# Altium project ATT-Light.PrjPcb
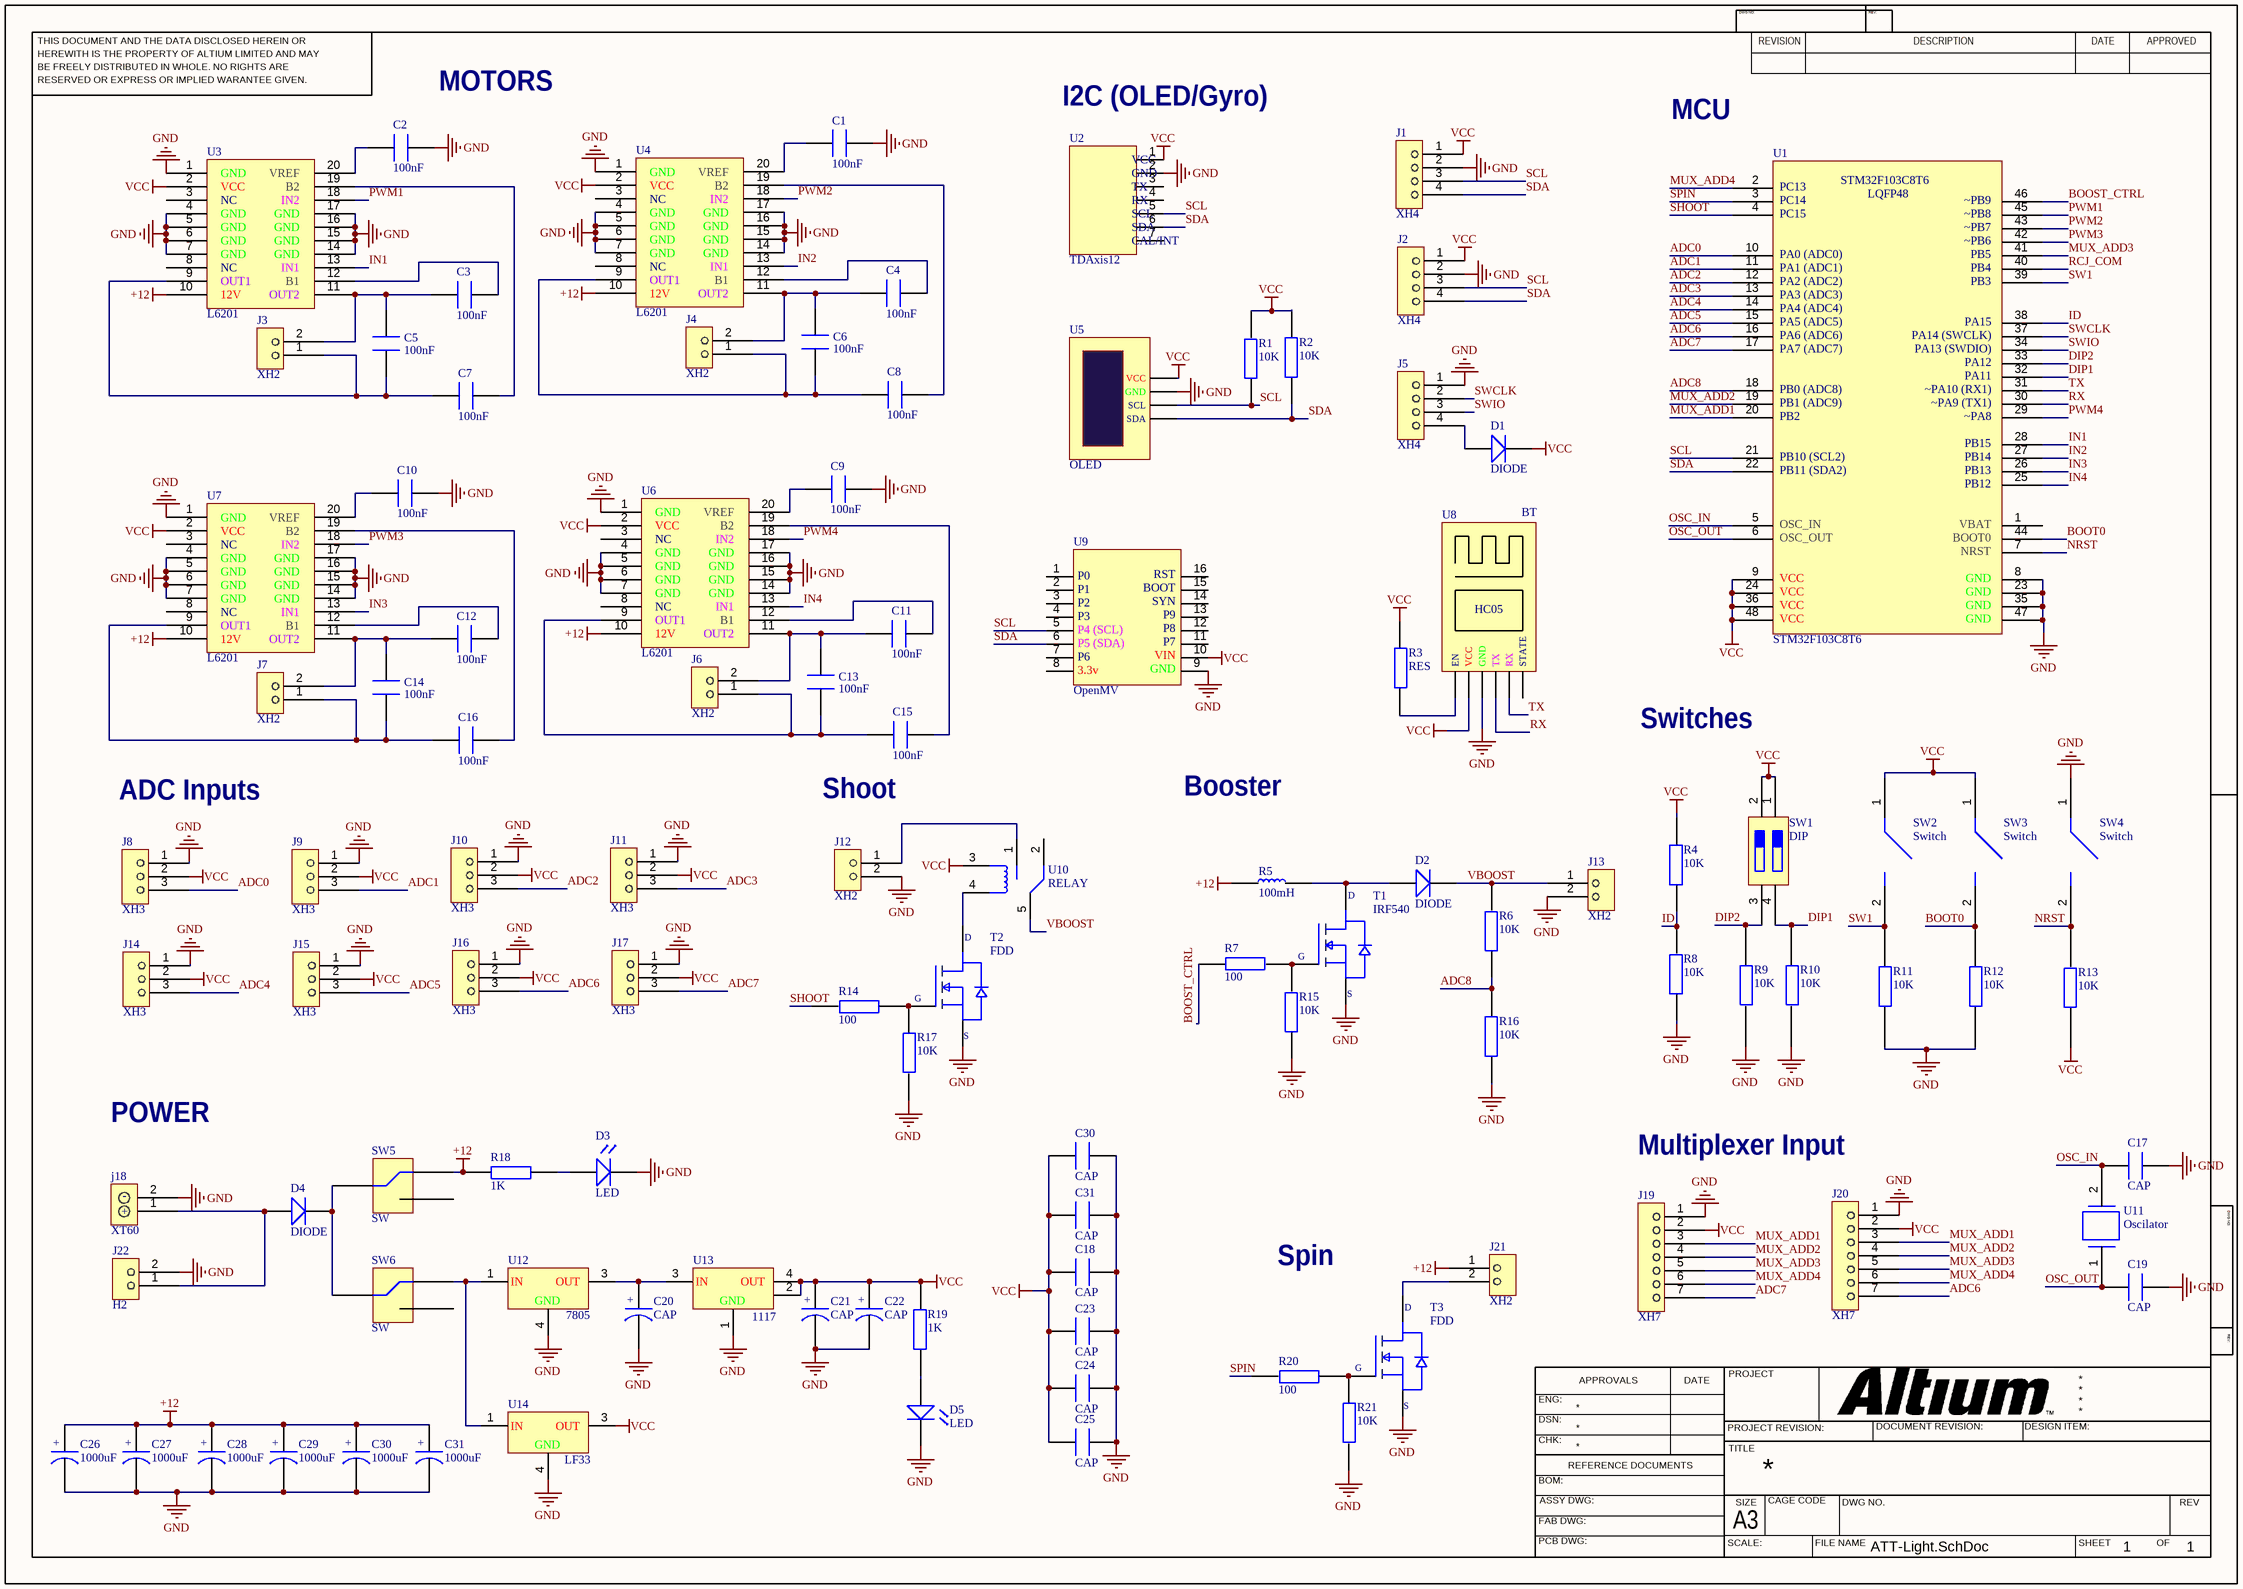
[diagram p0: ATT-Light.SchDoc]
1 sheet, 104 parts. Net scope: global (net labels, ports and power ports of the same name join across sheets).
Board file: ATT-Light.PcbDoc

## Sheet ATT-Light.SchDoc
size 420 x 297 mm; SheetNumber: 1; SheetTotal: 1

### Parts
(Parts that share a designator on the sheet are numbered #1, #2 ... from top to bottom, then left to right.)
C1  100nF  [CAP1206]
C2  100nF  [CAP1206]
C3  100nF  [CAP1206]
C4  100nF  [CAP1206]
C5  100nF  [CAP1206]
C6  100nF  [CAP1206]
C7  100nF  [CAP1206]
C8  100nF  [CAP1206]
C9  100nF  [CAP1206]
C10  100nF  [CAP1206]
C11  100nF  [CAP1206]
C12  100nF  [CAP1206]
C13  100nF  [CAP1206]
C14  100nF  [CAP1206]
C15  100nF  [CAP1206]
C16  100nF  [CAP1206]
C17  CAP  [CAP1206]
C18  CAP  [CAP1206]
C19  CAP  [CAP1206]
C20  CAP  [CAP SMD 100uF 16V]
C21  CAP  [CAP SMD 100uF 16V]
C22  CAP  [CAP SMD 100uF 16V]
C23  CAP  [CAP1206]
C24  CAP  [CAP1206]
C25  CAP  [CAP1206]
C26  1000uF  [CAP 5x10x13 black]
C27  1000uF  [CAP 5x10x13 black]
C28  1000uF  [CAP 5x10x13 black]
C29  1000uF  [CAP 5x10x13 black]
C30#1  CAP  [CAP1206]
C30#2  1000uF  [CAP 5x10x13 black]
C31#1  CAP  [CAP1206]
C31#2  1000uF  [CAP 5x10x13 black]
D1  DIODE  [Diode]
D2  DIODE  [Diode]
D3  LED  [LED GREEN 1206]
D4  DIODE  [Diode]
D5  LED  [LED GREEN 1206]
J1  XH4  [XH 4PIN]
J2  XH4  [XH 4PIN]
J3  XH2  [XH 2pin]
J4  XH2  [XH 2pin]
J5  XH4  [XH 4PIN]
J6  XH2  [XH 2pin]
J7  XH2  [XH 2pin]
J8  XH3  [XH 3PIN]
J9  XH3  [XH 3PIN]
J10  XH3  [XH 3PIN]
J11  XH3  [XH 3PIN]
J12  XH2  [XH 2pin]
J13  XH2  [XH 2pin]
J14  XH3  [XH 3PIN]
J15  XH3  [XH 3PIN]
J16  XH3  [XH 3PIN]
J17  XH3  [XH 3PIN]
j18  XT60  [XT60]
J19  XH7  [XH 7PIN]
J20  XH7  [XH 7PIN]
J21  XH2  [XH 2pin]
J22  H2  [H2 MOLEX]
R1  10K  [RES1206]
R2  10K  [RES1206]
R3  RES  [RES1206]
R4  10K  [RES1206]
R5  100mH  [inductor]
R6  10K  [RES1206]
R7  100  [RES1206]
R8  10K  [RES1206]
R9  10K  [RES1206]
R10  10K  [RES1206]
R11  10K  [RES1206]
R12  10K  [RES1206]
R13  10K  [RES1206]
R14  100  [RES1206]
R15  10K  [RES1206]
R16  10K  [RES1206]
R17  10K  [RES1206]
R18  1K  [RES1206]
R19  1K  [RES1206]
R20  100  [RES1206]
R21  10K  [RES1206]
SW1  DIP  [DIP Switch 2]
SW2  Switch  [pushbutton]
SW3  Switch  [pushbutton]
SW4  Switch  [pushbutton]
SW5  SW  [SPDT Switch]
SW6  SW  [SPDT Switch]
T1  IRF540  [IRF540S]
T2  FDD  [FDD6690A]
T3  FDD  [FDD6690A]
U1  STM32F103C8T6  [STM32F103C8T6]
U2  TDAxis12  [TDAxis12]
U3  L6201  [L6201]
U4  L6201  [L6201]
U5  OLED  [OLED SH1106]
U6  L6201  [L6201]
U7  L6201  [L6201]
U8  BT  [HC05]
U9  OpenMV  [OpenMV]
U10  RELAY  [Relay 5V 10A]
U11  Oscilator  [Crystal Oscilator]
U12  7805  [7805 (SOT-252)]
U13  1117  [AMS1117]
U14  LF33  [LF33]

### Nets
+12: C26.2 C27.2 C28.2 C29.2 C30#2.2 C31#2.2 J21.1 R5.1 R18.2 SW5.1 U3.10 U4.10 U6.10 U7.10
GND: C1.2 C2.2 C9.2 C10.2 C17.2 C18.1 C19.2 C20.1 C21.1 C22.1 C23.1 C24.1 C25.1 C26.1 C27.1 C28.1 C29.1 C30#1.1 C30#2.1 C31#1.1 C31#2.1 D3.2 D5.2 J1.2 J2.2 J5.1 J8.1 J9.1 J10.1 J11.1 J12.2 J13.2 J14.1 J15.1 J16.1 J17.1 j18.2 J19.1 J20.1 J22.2 R8.1 R9.2 R10.2 R11.2 R12.2 R15.1 R16.1 R17.2 R21.2 SW4.1 T1.3 T2.3 T3.3 U1.8 U1.23 U1.35 U1.47 U2.2 U3.1 U3.4 U3.5 U3.6 U3.7 U3.14 U3.15 U3.16 U3.17 U4.1 U4.4 U4.5 U4.6 U4.7 U4.14 U4.15 U4.16 U4.17 U5.2 U6.1 U6.4 U6.5 U6.6 U6.7 U6.14 U6.15 U6.16 U6.17 U7.1 U7.4 U7.5 U7.6 U7.7 U7.14 U7.15 U7.16 U7.17 U8.3 U9.9 U12.4 U13.1 U14.4
VCC: C18.2 C21.2 C22.2 C23.2 C24.2 C25.2 C30#1.2 C31#1.2 D1.2 J1.1 J2.1 J8.2 J9.2 J10.2 J11.2 J14.2 J15.2 J16.2 J17.2 J19.2 J20.2 R1.2 R2.2 R3.1 R4.2 R13.1 R19.2 SW1.1 SW1.2 SW2.1 SW3.1 U1.9 U1.24 U1.36 U1.48 U2.1 U3.2 U4.2 U5.1 U6.2 U7.2 U8.2 U9.10 U10.3 U13.2 U13.4 U14.3
ADC0: J8.3 U1.10
ADC1: J9.3 U1.11
ADC2: J10.3 U1.12
ADC3: J11.3 U1.13
ADC4: J14.3 U1.14
ADC5: J15.3 U1.15
ADC6: J16.3 J20.7 U1.16
ADC7: J17.3 J19.7 U1.17
ADC8: R6.1 R16.2 U1.18
BOOST_CTRL: R7.1 U1.46
BOOT0: R12.1 SW3.2 U1.44
DIP1: R10.1 SW1.4 U1.32
DIP2: R9.1 SW1.3 U1.33
ID: R4.1 R8.2 U1.38
IN1: U1.28 U3.13
IN2: U1.27 U4.13
IN3: U1.26 U7.13
IN4: U1.25 U6.13
MUX_ADD1: J19.3 J20.3 U1.20
MUX_ADD2: J19.4 J20.4 U1.19
MUX_ADD3: J19.5 J20.5 U1.41
MUX_ADD4: J19.6 J20.6 U1.2
NRST: R13.2 SW4.2 U1.7
OSC_IN: C17.1 U1.5 U11.2
OSC_OUT: C19.1 U1.6 U11.1
PWM1: U1.45 U3.18
PWM2: U1.43 U4.18
PWM3: U1.42 U7.18
PWM4: U1.29 U6.18
RCJ_COM: U1.40
RX: U1.30 U8.4
SCL: J1.3 J2.3 R1.1 U1.21 U2.5 U5.3 U9.5
SDA: J1.4 J2.4 R2.1 U1.22 U2.6 U5.4 U9.6
SHOOT: R14.2 U1.4
SPIN: R20.2 U1.3
SW1: R11.1 SW2.2 U1.39
SWCLK: J5.2 U1.37
SWIO: J5.3 U1.34
TX: U1.31 U8.5
VBOOST: D2.2 J13.1 R6.2 U10.5
NetC1_1: C1.1 U4.20
NetC2_1: C2.1 U3.20
NetC3_1: C3.1 U3.12
NetC3_2: C3.2 C5.2 J3.2 U3.11
NetC4_1: C4.1 U4.12
NetC4_2: C4.2 C6.2 J4.2 U4.11
NetC5_1: C5.1 C7.1 J3.1 U3.9
NetC6_1: C6.1 C8.1 J4.1 U4.9
NetC7_2: C7.2 U3.19
NetC8_2: C8.2 U4.19
NetC9_1: C9.1 U6.20
NetC10_1: C10.1 U7.20
NetC11_1: C11.1 U6.12
NetC11_2: C11.2 C13.2 J6.2 U6.11
NetC12_1: C12.1 U7.12
NetC12_2: C12.2 C14.2 J7.2 U7.11
NetC13_1: C13.1 C15.1 J6.1 U6.9
NetC14_1: C14.1 C16.1 J7.1 U7.9
NetC15_2: C15.2 U6.19
NetC16_2: C16.2 U7.19
NetC20_2: C20.2 U12.3 U13.3
NetD1_1: D1.1 J5.4
NetD2_1: D2.1 R5.2 T1.4
NetD3_1: D3.1 R18.1
NetD4_1: D4.1 j18.1 J22.1
NetD4_2: D4.2 SW5.2 SW6.2
NetD5_1: D5.1 R19.1
NetJ12_1: J12.1 U10.1
NetJ21_2: J21.2 T3.4
NetR3_2: R3.2 U8.1
NetR7_2: R7.2 R15.2 T1.1
NetR14_1: R14.1 R17.1 T2.1
NetR20_1: R20.1 R21.1 T3.1
NetSW6_1: SW6.1 U12.1 U14.1
NetT2_4: T2.4 U10.4

Not connected (* = marked no-connect by the designer): SW5 3; SW6 3; U1 1; U2 3 4 7; U3 3 8; U4 3 8; U6 3 8; U7 3 8; U8 6; U9 1 2 3 4 7 8 11 12 13 14 15 16; U10 2

### Notes on the sheet
- MOTORS
- (near U2) I2C (OLED/Gyro)
- MCU
- Switches
- ADC Inputs
- Shoot
- Booster
- POWER
- Multiplexer Input
- Spin
- THIS DOCUMENT AND THE DATA DISCLOSED HEREIN OR
- HEREWITH IS THE PROPERTY OF ALTIUM LIMITED AND MAY
- DWG NO:
- REVISION
- REV:
- DESCRIPTION
- DATE
- APPROVED
- BE FREELY DISTRIBUTED IN WHOLE. NO RIGHTS ARE
- RESERVED OR EXPRESS OR IMPLIED WARANTEE GIVEN.
- ENG:
- APPROVALS
- PROJECT
- DSN:
- CHK:
- REFERENCE DOCUMENTS
- PROJECT REVISION:
- TITLE
- DOCUMENT REVISION:
- DESIGN ITEM:
- BOM:
- FAB DWG:
- PCB DWG:
- ASSY DWG:
- SCALE:
- A3
- SIZE
- CAGE CODE
- FILE NAME
- DWG NO.
- SHEET
- OF
- REV
- (in symbol 7805 (SOT-252)) IN; OUT; GND
- (in symbol AMS1117) IN; OUT; GND
- (in symbol CAP Electrolit SMD) +
- (in symbol Cap Electrolyte) +
- (in symbol FDD6690A) D; G; S
- (in symbol HC05) EN; VCC; GND; TX; RX; STATE
- (in symbol IRF540S) D; G; S
- (in symbol L6201) GND; VREF; VCC; B2; NC; IN2; IN1; OUT1; B1; 12V; OUT2
- (in symbol LF33) IN; OUT; GND
- (in symbol OLED SH1106) VCC; GND; SCL; SDA
- (in symbol OpenMV) RST; P0; BOOT; P1; SYN; P2; P9; P3; P8; P4 (SCL); P7; P5 (SDA); VIN; P6; GND; 3.3v
- (in symbol STM32F103C8T6) PC13; LQFP48; ~PB9; PC14; ~PB8; PC15; ~PB7; ~PB6; PB5; PA0 (ADC0); PB4; PA1 (ADC1); PB3; PA2 (ADC2); PA3 (ADC3); PA4 (ADC4); PA15; PA5 (ADC5); PA14 (SWCLK); PA6 (ADC6); PA13 (SWDIO); PA7 (ADC7); PA12; PA11; ~PA10 (RX1); PB0 (ADC8); ~PA9 (TX1); PB1 (ADC9); ~PA8; PB2; PB15; PB14; PB10 (SCL2); PB13; PB11 (SDA2); PB12; VBAT; OSC_IN; BOOT0; OSC_OUT; NRST; GND; VCC
- (in symbol TDAxis12) VCC; GND; TX; RX; SCL; SDA; CAL/INT
- (in symbol XT60) -; +

### Library data of the parts
C1-C19 C23-C25 C30#1 C31#1 = CAP1206: Capacitor SMD 1206
C20-C22 = CAP Electrolit SMD: Capacitor Electrolit SMD
C26-C29 C30#2 C31#2 = Cap Electrolyte: CAP DIP
D3 D5 = LED SMD 1206
J1 J2 J5 = XH 4PIN: XH Connector 4pins
J3 J4 J6 J7 J12 J13 J21 = XH 2PIN: XH Connector 2pins
J8-J11 J14-J17 = XH 3PIN: XH Connector 3pins
j18 = XT60: XT60 Power Connector
J19 J20 = XH 7Pin: XH Connector 7pins
J22 = H2 MOLEX: molex connector
R1-R4 R6-R21 = RES1206: RESISTOR SMD
R5 = inductor: SELF INDUCTOR
SW1 = DIP SW 2: DIP Switch 2 pin
SW2-SW4 = pushbutton: Switch SMD Tact
SW5 SW6 = SPDT Switch: SPDT Power Switch
T1 = IRF540S: IRF-540 MOSFET N-Chanel
T2 T3 = FDD6690A: FDD6690A MOSFET N-Chanel
U1 = STM32F103C8T6: STM32F103C8T6 / LQFP48
U2 = TDAxis12: Gyroscpoe Sensor
U5 = OLED SH1106: OLED SH1106 1.3inch
U8 = HC05: Bluetooth HC05 Module
U9 = OpenMV: OpenMV Camera H7 R2
U10 = Relay 5V 10A
U11 = Crystal: Crystal Oscilator 8MHz
U12 = 7805 (SOT-252): 5v Regulator
U13 = AMS1117: 3.3v Regulator
U14 = LF33: 3.3V Regulator